# Altium schematic sheet ESP32.SchDoc
size A4; SheetNumber: 2; SheetTotal: 3
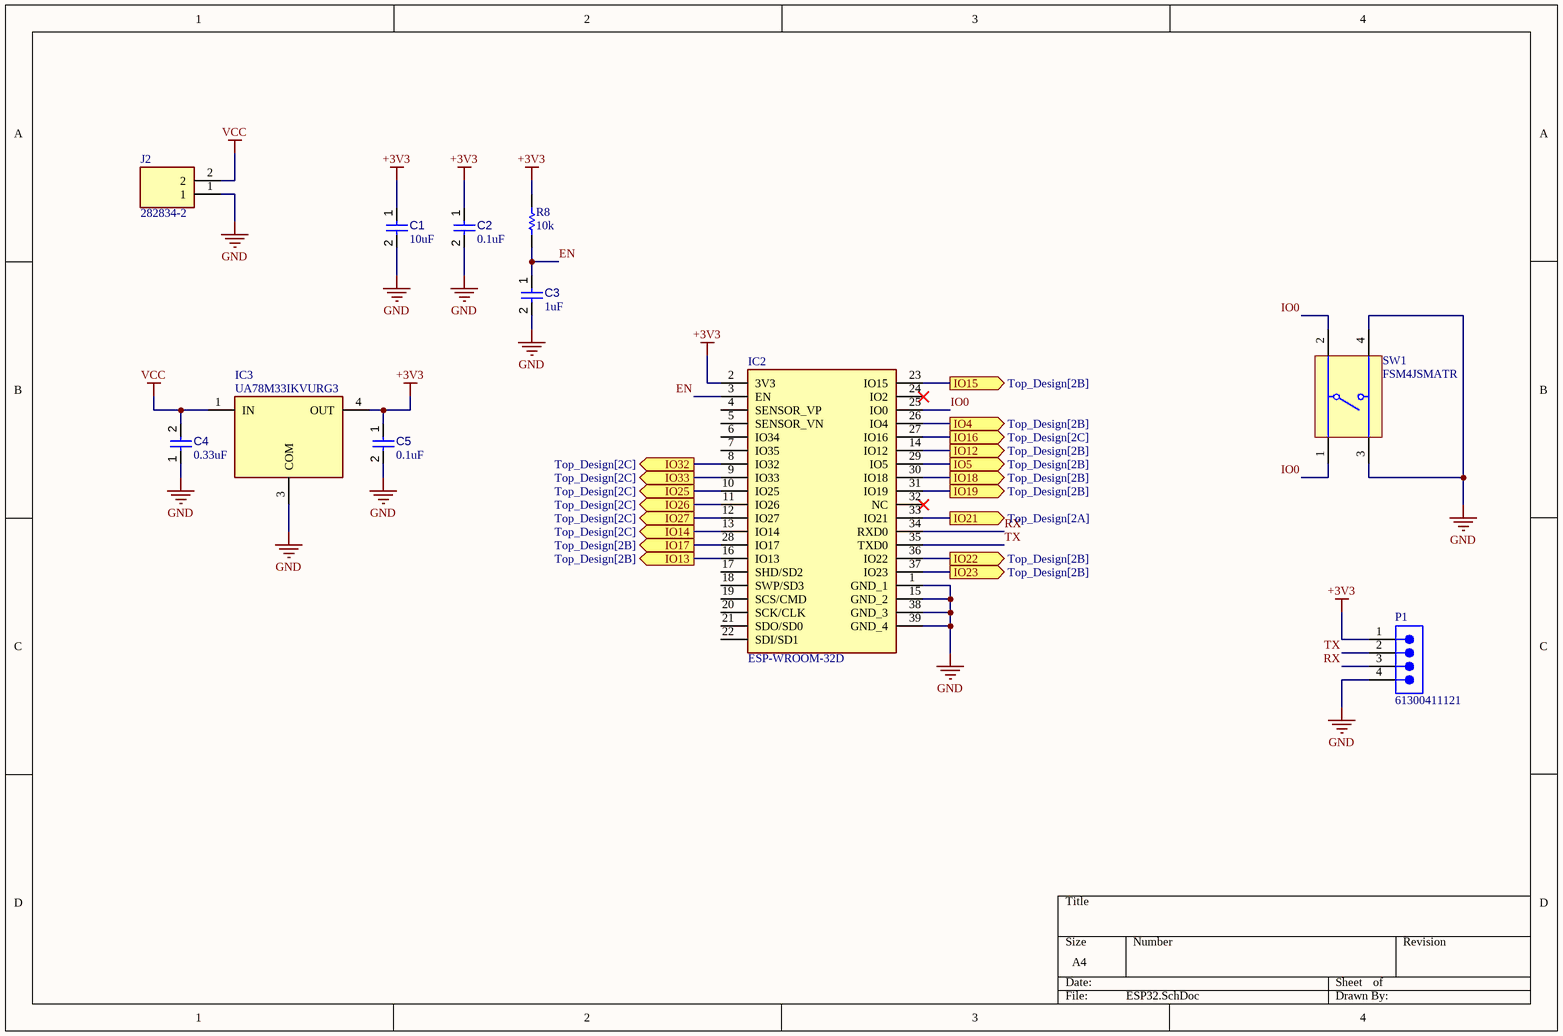
[diagram p0: ESP32.SchDoc]

## Parts
C1  value 10uF  [CAPC2013X95X50LL10T25]  (hidden comment: Capacitor 10 µF +/-10% 50 V 0805)
C2  value 0.1uF  [CAPC2013X95X50LL10T25]  (hidden comment: Capacitor 0.1 µF +/-10% 50 V 0805)
C3  value 1uF  [CAPC2013X95X50LL10T25]  (hidden comment: Capacitor 100 nF +/-10% 50 V 0805)
C4  value 0.33uF  [CAPC2013X95X50LL10T25]  (hidden comment: Capacitor 100 nF +/-10% 50 V 0805)
C5  value 0.1uF  [CAPC2013X95X50LL10T25]  (hidden comment: Capacitor 100 nF +/-10% 50 V 0805)
IC2  ESP-WROOM-32D  [ESPWROOM32D]
IC3  UA78M33IKVURG3  [UA78M33IKVURG3]
J2  282834-2  [282834-2_1]
P1  61300411121  [61300411121]
R8  value 10k  [RESC2013X70X40ML20T20]  (hidden comment: Resistor 1k +/-1% 0805 125 mW)
SW1  FSM4JSMATR  [TECO-FSM4JSMATR_V]

## Ports
IO4 (out, see Top_Design[2B]), IO5 (out, see Top_Design[2B]), IO12 (out, see Top_Design[2B]), IO13 (out, see Top_Design[2B]), IO14 (out, see Top_Design[2C]), IO15 (out, see Top_Design[2B]), IO16 (out, see Top_Design[2C]), IO17 (out, see Top_Design[2B]), IO18 (out, see Top_Design[2B]), IO19 (out, see Top_Design[2B]), IO21 (out, see Top_Design[2A]), IO22 (out, see Top_Design[2B]), IO23 (out, see Top_Design[2B]), IO25 (out, see Top_Design[2C]), IO26 (out, see Top_Design[2C]), IO27 (out, see Top_Design[2C]), IO32 (out, see Top_Design[2C]), IO33 (out, see Top_Design[2C])

## Nets
+3V3: C1.1 C2.1 C5.1 IC2.2(3V3) IC3.4(OUT) P1.1 R8.2
GND: C1.2 C2.2 C3.2 C4.1 C5.2 IC2.1(GND_1) IC2.15(GND_2) IC2.38(GND_3) IC2.39(GND_4) IC3.3(COM) J2.1 P1.4 SW1.3 SW1.4
VCC: C4.2 IC3.1(IN) J2.2
EN: C3.1 IC2.3(EN) R8.1
IO0: IC2.25(IO0) SW1.1 SW1.2
IO4: IC2.26(IO4) ; port IO4
IO5: IC2.29(IO5) ; port IO5
IO12: IC2.14(IO12) ; port IO12
IO13: IC2.16(IO13) ; port IO13
IO14: IC2.13(IO14) ; port IO14
IO15: IC2.23(IO15) ; port IO15
IO16: IC2.27(IO16) ; port IO16
IO17: IC2.28(IO17) ; port IO17
IO18: IC2.30(IO18) ; port IO18
IO19: IC2.31(IO19) ; port IO19
IO21: IC2.33(IO21) ; port IO21
IO22: IC2.36(IO22) ; port IO22
IO23: IC2.37(IO23) ; port IO23
IO25: IC2.10(IO25) ; port IO25
IO26: IC2.11(IO26) ; port IO26
IO27: IC2.12(IO27) ; port IO27
IO32: IC2.8(IO32) ; port IO32
IO33: IC2.9(IO33) ; port IO33
RX: IC2.34(RXD0) P1.3
TX: IC2.35(TXD0) P1.2

Not connected (* = marked no-connect by the designer): IC2 4(SENSOR_VP) 5(SENSOR_VN) 6(IO34) 7(IO35) 17(SHD/SD2) 18(SWP/SD3) 19(SCS/CMD) 20(SCK/CLK) 21(SDO/SD0) 22(SDI/SD1) 24(IO2)* 32(NC)*

## Library data of the parts
C1 = CMP-001-00018-6: Chip Capacitor, 10 µF, +/- 10%, 50 V, 0805 (2012 Metric); Capacitor Type: Ceramic; Voltage Rating: 50V; Pins: 2; Max Operating Temperature: 125°C; Min Operating Temperature: -55°C; Mounting Technology: SM; Case/Package: 0805; RoHS Compliant: True; Tolerance: 10%
C2 C5 = CMP-001-00018-6: Chip Capacitor, 100 nF, +/- 10%, 50 V, 0805 (2012 Metric); Capacitor Type: Ceramic; Voltage Rating: 50V; Pins: 2; Max Operating Temperature: 125°C; Min Operating Temperature: -55°C; Mounting Technology: SM; Case/Package: 0805; RoHS Compliant: True; Tolerance: 10%
C3 = CMP-001-00018-6: Chip Capacitor, 1 µF, +/- 10%, 50 V, 0805 (2012 Metric); Capacitor Type: Ceramic; Voltage Rating: 50V; Pins: 2; Max Operating Temperature: 125°C; Min Operating Temperature: -55°C; Mounting Technology: SM; Case/Package: 0805; RoHS Compliant: True; Tolerance: 10%
C4 = CMP-001-00018-6: Chip Capacitor, 0.33 µF, +/- 10%, 50 V, 0805 (2012 Metric); Capacitor Type: Ceramic; Voltage Rating: 50V; Pins: 2; Max Operating Temperature: 125°C; Min Operating Temperature: -55°C; Mounting Technology: SM; Case/Package: 0805; RoHS Compliant: True; Tolerance: 10%
IC2 = ESP-WROOM-32D: Integrated Circuit; Manufacturer_Name: Espressif Systems; Datasheet Link: https://componentsearchengine.com/Datasheets/1/ESP-WROOM-32D.pdf; Height: 3.2mm; Manufacturer_Part_Number: ESP-WROOM-32D; Mouser Part Number: 356-ESP-WROOM-32D; Mouser Price/Stock: https://www.mouser.co.uk/ProductDetail/Espressif-Systems/ESP-WROOM-32D?qs=MLItCLRbWsyWVKgdQMcFuQ%3D%3D
IC3 = UA78M33IKVURG3: Integrated Circuit; pin to pad: 3>4 4>3; Manufacturer_Name: Texas Instruments; Datasheet Link: http://www.ti.com/lit/gpn/ua78m; Height: 2.52mm; Manufacturer_Part_Number: UA78M33IKVURG3; Mouser Part Number: 595-UA78M33IKVURG3; Mouser Price/Stock: https://www.mouser.co.uk/ProductDetail/Texas-Instruments/UA78M33IKVURG3?qs=dP8SwFlKThxMmGpfgS%2FADQ%3D%3D; Arrow Part Number: UA78M33IKVURG3; Arrow Price/Stock: https://www.arrow.com/en/products/ua78m33ikvurg3/texas-instruments?region=nac
J2 = 282834-2: Connector; Manufacturer_Name: TE Connectivity; Datasheet Link: https://www.te.com/commerce/DocumentDelivery/DDEController?Action=srchrtrv&DocNm=1-1773458-1_EURO_STYLE_QRG&DocType=Data%20Sheet&DocLang=English&PartCntxt=282834-2&DocFormat=pdf; Manufacturer_Part_Number: 282834-2; Mouser Part Number: 571-282834-2; Mouser Price/Stock: https://www.mouser.co.uk/ProductDetail/TE-Connectivity/282834-2?qs=A%252Bip%252BNCYi6N8cVKuk8xDog%3D%3D; Arrow Part Number: 282834-2; Arrow Price/Stock: https://www.arrow.com/en/products/282834-2/te-connectivity?utm_currency=USD&region=europe
P1 = CMP-1502-01064-3: NexarPartId: 32855522; Operating Supply Voltage: 250V; Pitch: 2.54mm; Contact Resistance: 20mΩ; Number of Positions: 4; Current Rating: 3A; Connector Type: Male Pin; Gender: Male; Contact Plating: Gold; Height: 8.89mm; Lead Pitch: 2.54mm; Lead Free: Lead Free; Contact Mating Length: 5.9944mm; Number of Rows: 1; Termination: Solder; Packaging: Bulk; REACH SVHC: Unknown; Min Operating Temperature: -40°C; RoHS: Compliant; Number of Contacts: 4; Voltage Rating: 250V; Color: Black; Max Operating Temperature: 105°C; Contact Material: Copper; Mount: Through Hole; Orientation: Vertical; Number of Pins: 4
R8 = CMP-009-00010-5: Chip Resistor, 10 KOhm, +/- 1%, 0.125 W, -55 to 155 degC, 0805 (2013 Metric); Power: 125mW; Voltage Rating: 150V; Tolerance: 1%; RoHS Compliant: True; Mounting Technology: SM; Pins: 2; Case/Package: 0805; Max Operating Temperature: 155°C; Min Operating Temperature: -55°C
SW1 = CMP-2000-07486-1: Micro Miniature Push Button Switch FSM JSM, 50 mA, -35 to 85 degC, 4-Pin SMD, RoHS, Tape and Reel; Manufacturer: TE Connectivity; Mechanical Life: 100000Cycles; Current Rating: 50mA; Actuator Material: Polyamide; Max Voltage Rating (DC): 12V; Capacitance: 0f; Illumination Type: Illuminated; Voltage Rating (DC): 24V; Case\/Package: SMD/SMT; Operating Force: 160gf; Contact Resistance: 100mOhm; Actuator Length: 0.055inch; Switch Travel: 0.25mm; Throw Configuration: SPST; Termination: GullWing; Contact Plating: Silver; Orientation: Straight; Mounting Technology: SurfaceMount; REACH SVHC: Unknown; Electrical Life: 100000Cycles; Package Reference: FSM4JSMATR; Max Operating Temperature: 85degC; Manufacturer URL: http://www.te.com/; Package Description: 4-Pin Surface Mount Device, Body 6 x 6 mm, Pitch 4.5 mm; Datasheet Version: Rev. V, 02/2015; Packaging: TapeandReel; Min Operating Temperature: -35degC; Mount: SurfaceMount; Contact Current Rating: 50mA; Contact Material: CopperAlloy; Package Quantity: 1200; Datasheet URL: http://www.te.com/commerce/DocumentDelivery/DDEController?Action=showdoc&DocId=Customer+Drawing%7F2-1437565-7%7FV%7Fpdf%7FEnglish%7FENG_CD_2-1437565-7_V.pdf%7F4-1437565-2; RoHSCompliant: true